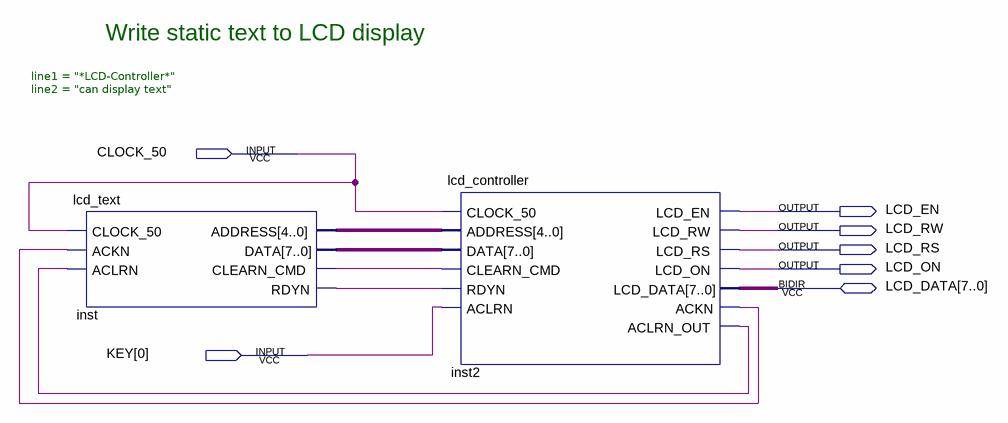
[diagram p0: schematic sheet]
// Quartus schematic lcd_demo_text.bdf as structural Verilog: 2 symbols, 7 pins
module lcd_demo_text (
  input  CLOCK_50,
  input  [0:0] KEY,
  inout  [7:0] LCD_DATA,
  output LCD_EN,
  output LCD_RW,
  output LCD_RS,
  output LCD_ON
);

  wire inst2_ackn, inst2_aclrn_out, inst_clearn_cmd, inst_rdyn;
  wire [4:0] inst_address;
  wire [7:0] inst_data;

  lcd_text #(.line1("*LCD-Controller*"), .line2("can display text")) inst (
    .CLOCK_50(CLOCK_50), .ACKN(inst2_ackn), .ACLRN(inst2_aclrn_out), .ADDRESS(inst_address),
    .DATA(inst_data), .CLEARN_CMD(inst_clearn_cmd), .RDYN(inst_rdyn));
  lcd_controller inst2 (
    .CLOCK_50(CLOCK_50), .ADDRESS(inst_address), .DATA(inst_data), .CLEARN_CMD(inst_clearn_cmd),
    .RDYN(inst_rdyn), .ACLRN(KEY[0]), .LCD_EN(LCD_EN), .LCD_RW(LCD_RW), .LCD_RS(LCD_RS), .LCD_ON(LCD_ON),
    .ACKN(inst2_ackn), .ACLRN_OUT(inst2_aclrn_out), .LCD_DATA(LCD_DATA));

  // Notes on the sheet:
  //   Write static text to LCD display
endmodule
